# Altium schematic sheet ARM2toARM3PGA_FPA.SchDoc: ARM2 to ARM3 Adapter
size A3; DocumentNumber: 1; SheetNumber: 1; SheetTotal: 1
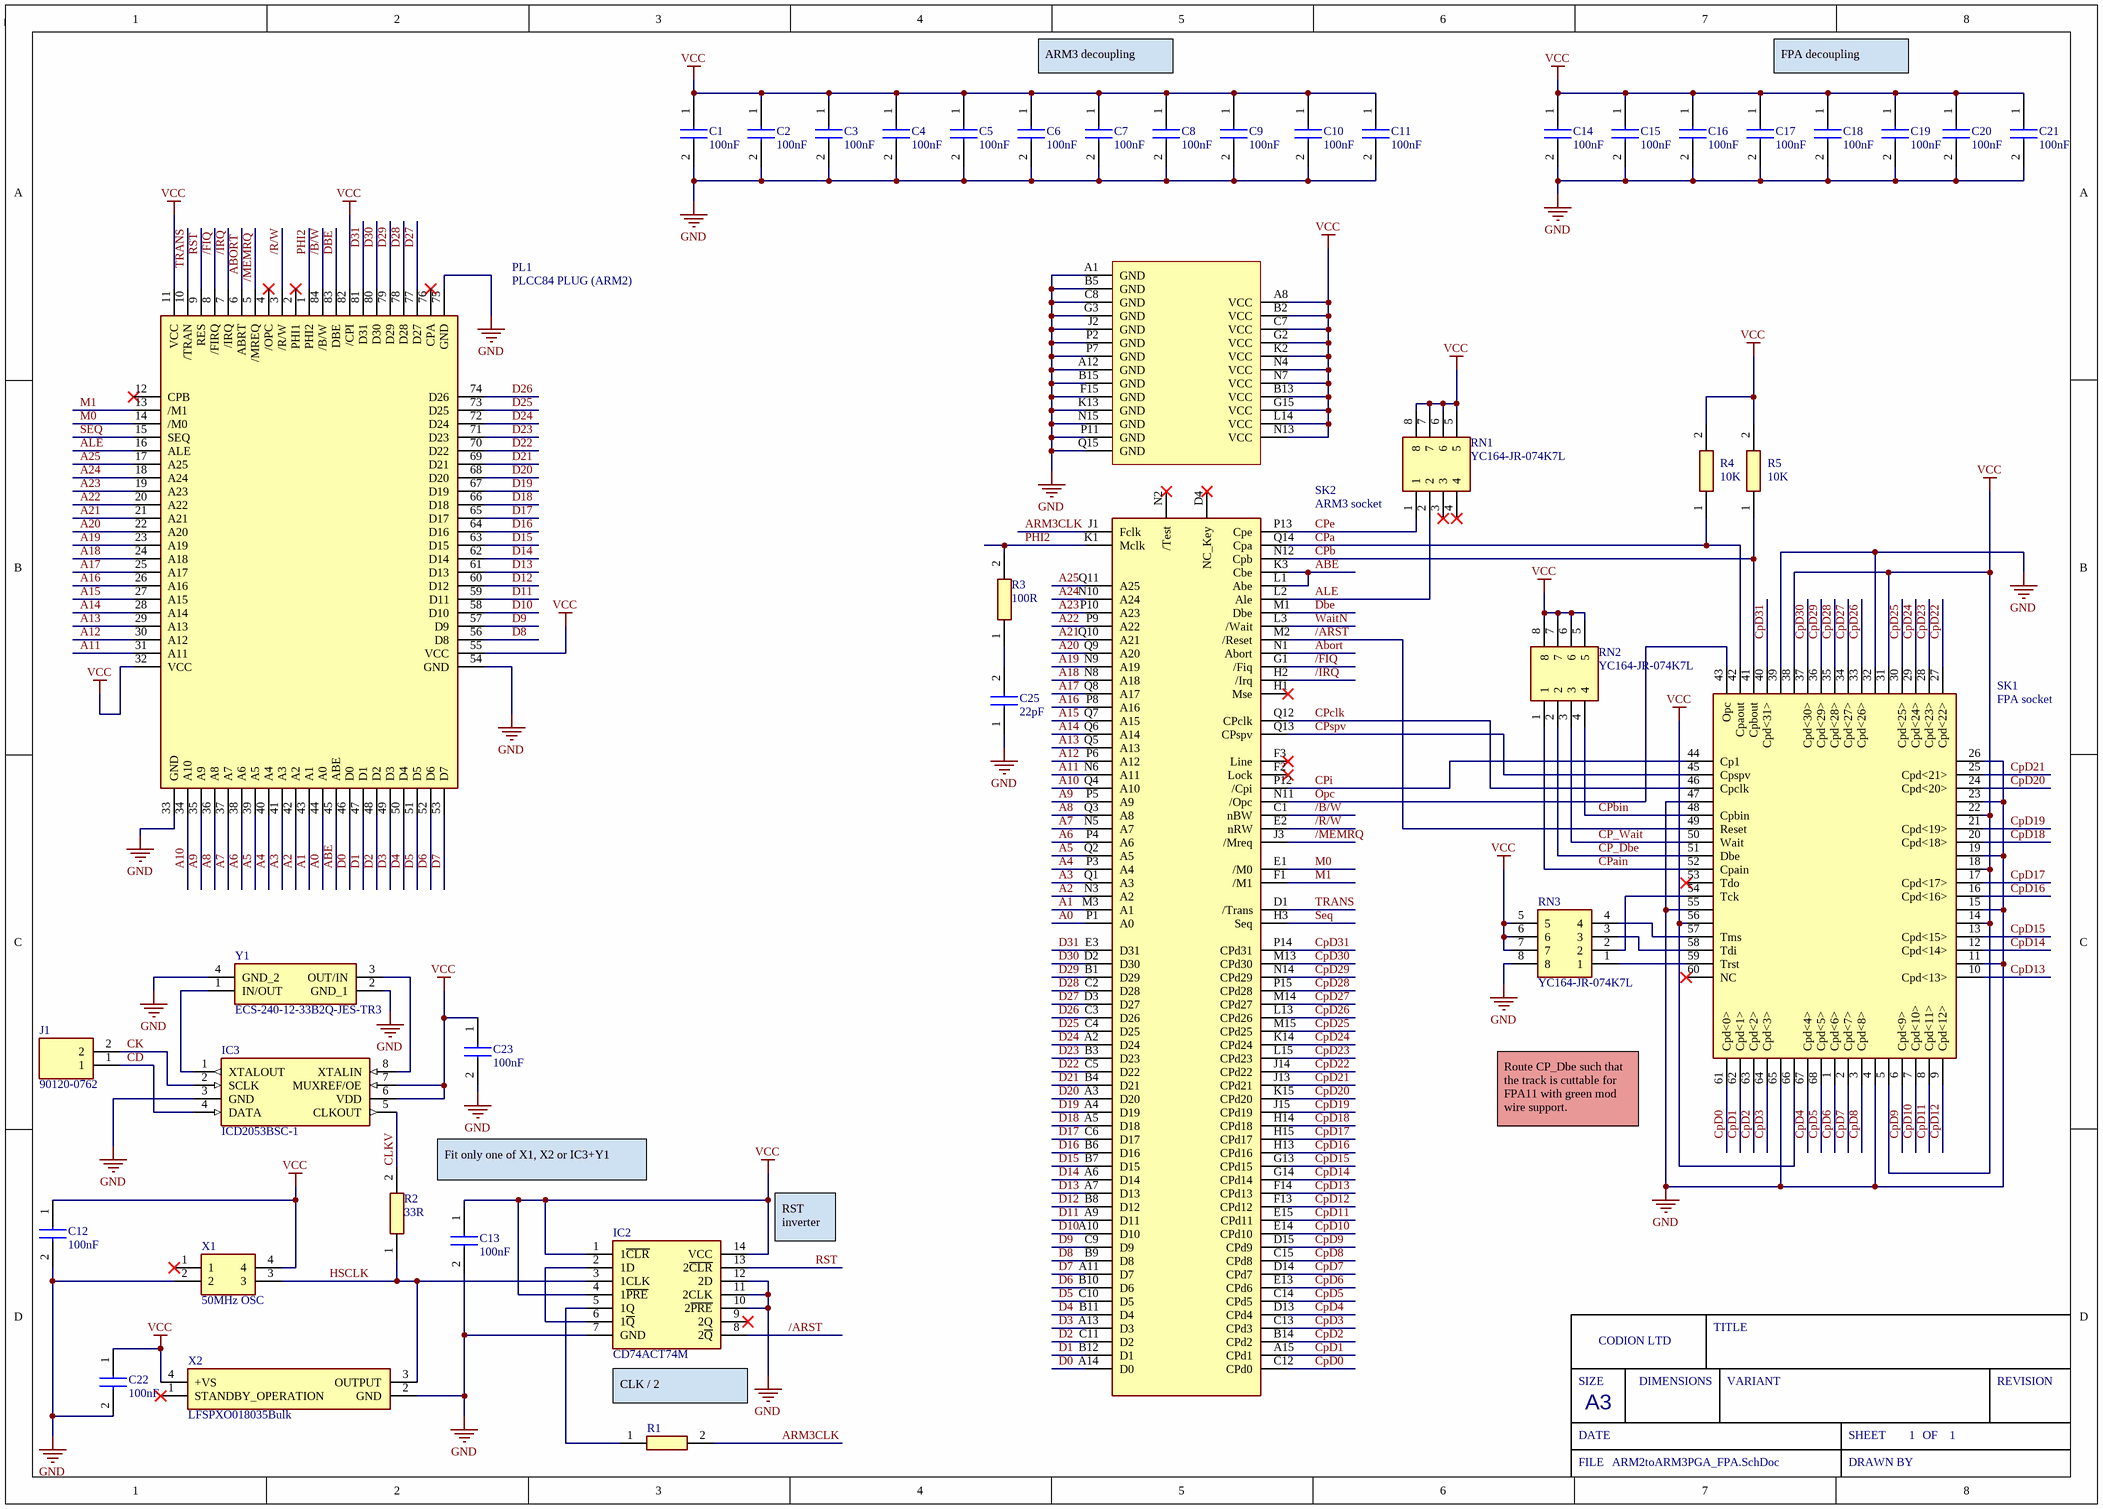
[diagram p0: ARM2toARM3PGA_FPA.SchDoc]

## Parts
C1  100nF  [CAPC2012X145N]
C2  100nF  [CAPC2012X145N]
C3  100nF  [CAPC2012X145N]
C4  100nF  [CAPC2012X145N]
C5  100nF  [CAPC2012X145N]
C6  100nF  [CAPC2012X145N]
C7  100nF  [CAPC2012X145N]
C8  100nF  [CAPC2012X145N]
C9  100nF  [CAPC2012X145N]
C10  100nF  [CAPC2012X145N]
C11  100nF  [CAPC2012X145N]
C12  100nF  [CAPC2012X145N]
C13  100nF  [CAPC2012X145N]
C14  100nF  [CAPC2012X145N]
C15  100nF  [CAPC2012X145N]
C16  100nF  [CAPC2012X145N]
C17  100nF  [CAPC2012X145N]
C18  100nF  [CAPC2012X145N]
C19  100nF  [CAPC2012X145N]
C20  100nF  [CAPC2012X145N]
C21  100nF  [CAPC2012X145N]
C22  100nF  [CAPC2012X145N]
C23  100nF  [CAPC2012X145N]
C25  22pF  [CAPC1608X90N]
IC2  CD74ACT74M  [SOIC127P600X175-14N]
IC3  ICD2053BSC-1  [SOIC127P602X173-8N]
J1  90120-0762  [HDRV2W35P0X254_1X2_508X249X560P]
PL1  PLCC84 PLUG (ARM2)  [PLCC84_PLUG]
R1  CRCW080568R0FKEA  [RESC2012X50N]  (value not drawn)
R2  33R  [RESC1005X40N]
R3  100R  [RESC2012X60N]
R4  10K  [RESC2012X60N]
R5  10K  [RESC2012X60N]
RN1  YC164-JR-074K7L  [YC164JR07220RL]
RN2  YC164-JR-074K7L  [YC164JR07220RL]
RN3  YC164-JR-074K7L  [YC164JR07220RL]
SK1  FPA socket  [MEMC_Socket]
SK2  ARM3 socket  [PGA_ARM3]
X1  50MHz OSC  [DIPS762W56P1524L1778H241Q4N]
X2  LFSPXO018035Bulk  [LFSPXO018035Bulk]
Y1  ECS-240-12-33B2Q-JES-TR3  [ECS2401233B2QJESTR3]

## Nets
GND: C1.2 C2.2 C3.2 C4.2 C5.2 C6.2 C7.2 C8.2 C9.2 C10.2 C11.2 C12.2 C13.2 C14.2 C15.2 C16.2 C17.2 C18.2 C19.2 C20.2 C21.2 C22.2 C23.2 C25.1 IC2.7(GND) IC2.10(2~{PRE}) IC2.11(2CLK) IC2.12(2D) IC3.3(GND) PL1.33(GND) PL1.54(GND) PL1.75(GND) RN3.8 SK1.4 SK1.11 SK1.15 SK1.19 SK1.23 SK1.26 SK1.32 SK1.39 SK1.47 SK1.55 SK1.65 SK2.A1(GND) SK2.A12(GND) SK2.B5(GND) SK2.B15(GND) SK2.C8(GND) SK2.F15(GND) SK2.G3(GND) SK2.J2(GND) SK2.K13(GND) SK2.N15(GND) SK2.P2(GND) SK2.P7(GND) SK2.P11(GND) SK2.Q15(GND) X1.2 X2.2(GND) Y1.2(GND_1) Y1.4(GND_2)
VCC: C1.1 C2.1 C3.1 C4.1 C5.1 C6.1 C7.1 C8.1 C9.1 C10.1 C11.1 C12.1 C13.1 C14.1 C15.1 C16.1 C17.1 C18.1 C19.1 C20.1 C21.1 C22.1 C23.1 IC2.1(1~{CLR}) IC2.4(1~{PRE}) IC2.14(VCC) IC3.6(VDD) IC3.7(MUXREF/OE) PL1.11(VCC) PL1.32(VCC) PL1.55(VCC) PL1.82(/CPI) R4.2 R5.2 RN1.5 RN1.6 RN1.7 RN1.8 RN2.5 RN2.6 RN2.7 RN2.8 RN3.5 RN3.6 RN3.7 SK1.5 SK1.14 SK1.18 SK1.22 SK1.31 SK1.38 SK1.56 SK1.66 SK2.A8(VCC) SK2.B2(VCC) SK2.B13(VCC) SK2.C7(VCC) SK2.G2(VCC) SK2.G15(VCC) SK2.K2(VCC) SK2.L14(VCC) SK2.N4(VCC) SK2.N7(VCC) SK2.N13(VCC) X1.4 X2.4(+VS)
/ARST: IC2.8(2~{Q}) SK1.49(Reset) SK2.M2(/Reset)
/B/W: PL1.84(/B/W) SK2.C1(nBW)
/FIQ: PL1.8(/FIRQ) SK2.G1(/Fiq)
/IRQ: PL1.7(/IRQ) SK2.H2(/Irq)
/MEMRQ: PL1.5(/MREQ) SK2.J3(/Mreq)
/R/W: PL1.3(/R/W) SK2.E2(nRW)
A0: PL1.44(A0) SK2.P1(A0)
A1: PL1.43(A1) SK2.M3(A1)
A2: PL1.42(A2) SK2.N3(A2)
A3: PL1.41(A3) SK2.Q1(A3)
A4: PL1.40(A4) SK2.P3(A4)
A5: PL1.39(A5) SK2.Q2(A5)
A6: PL1.38(A6) SK2.P4(A6)
A7: PL1.37(A7) SK2.N5(A7)
A8: PL1.36(A8) SK2.Q3(A8)
A9: PL1.35(A9) SK2.P5(A9)
A10: PL1.34(A10) SK2.Q4(A10)
A11: PL1.31(A11) SK2.N6(A11)
A12: PL1.30(A12) SK2.P6(A12)
A13: PL1.29(A13) SK2.Q5(A13)
A14: PL1.28(A14) SK2.Q6(A14)
A15: PL1.27(A15) SK2.Q7(A15)
A16: PL1.26(A16) SK2.P8(A16)
A17: PL1.25(A17) SK2.Q8(A17)
A18: PL1.24(A18) SK2.N8(A18)
A19: PL1.23(A19) SK2.N9(A19)
A20: PL1.22(A20) SK2.Q9(A20)
A21: PL1.21(A21) SK2.Q10(A21)
A22: PL1.20(A22) SK2.P9(A22)
A23: PL1.19(A23) SK2.P10(A23)
A24: PL1.18(A24) SK2.N10(A24)
A25: PL1.17(A25) SK2.Q11(A25)
ABE: PL1.45(ABE) SK2.K3(Cbe) SK2.L1(Abe)
ABORT: PL1.6(ABRT) SK2.N1(Abort)
ALE: PL1.16(ALE) RN1.2 SK2.L2(Ale)
ARM3CLK: R1.2 SK2.J1(Fclk)
CD: IC3.4(DATA) J1.1
CK: IC3.2(SCLK) J1.2
CLKV: IC3.5(CLKOUT) R2.2
CP_Dbe: RN2.2 SK1.51(Dbe)
CP_Wait: RN2.3 SK1.50(Wait)
CPa: R4.1 SK1.42(Cpaout) SK2.Q14(Cpa)
CPain: RN2.1 SK1.52(Cpain)
CPb: R5.1 SK1.41(Cpbout) SK2.N12(Cpb)
CPbin: RN2.4 SK1.48(Cpbin)
CPclk: SK1.46(Cpclk) SK2.Q12(CPclk)
CpD0: SK1.61(Cpd<0>) SK2.C12(CPd0)
CpD1: SK1.62(Cpd<1>) SK2.A15(CPd1)
CpD2: SK1.63(Cpd<2>) SK2.B14(CPd2)
CpD3: SK1.64(Cpd<3>) SK2.C13(CPd3)
CpD4: SK1.67(Cpd<4>) SK2.D13(CPd4)
CpD5: SK1.68(Cpd<5>) SK2.C14(CPd5)
CpD6: SK1.1(Cpd<6>) SK2.E13(CPd6)
CpD7: SK1.2(Cpd<7>) SK2.D14(CPd7)
CpD8: SK1.3(Cpd<8>) SK2.C15(CPd8)
CpD9: SK1.6(Cpd<9>) SK2.D15(CPd9)
CpD10: SK1.7(Cpd<10>) SK2.E14(CPd10)
CpD11: SK1.8(Cpd<11>) SK2.E15(CPd11)
CpD12: SK1.9(Cpd<12>) SK2.F13(CPd12)
CpD13: SK1.10(Cpd<13>) SK2.F14(CPd13)
CpD14: SK1.12(Cpd<14>) SK2.G14(CPd14)
CpD15: SK1.13(Cpd<15>) SK2.G13(CPd15)
CpD16: SK1.16(Cpd<16>) SK2.H13(CPd16)
CpD17: SK1.17(Cpd<17>) SK2.H15(CPd17)
CpD18: SK1.20(Cpd<18>) SK2.H14(CPd18)
CpD19: SK1.21(Cpd<19>) SK2.J15(CPd19)
CpD20: SK1.24(Cpd<20>) SK2.K15(CPd20)
CpD21: SK1.25(Cpd<21>) SK2.J13(CPd21)
CpD22: SK1.27(Cpd<22>) SK2.J14(CPd22)
CpD23: SK1.28(Cpd<23>) SK2.L15(CPd23)
CpD24: SK1.29(Cpd<24>) SK2.K14(CPd24)
CpD25: SK1.30(Cpd<25>) SK2.M15(CPd25)
CpD26: SK1.33(Cpd<26>) SK2.L13(CPd26)
CpD27: SK1.34(Cpd<27>) SK2.M14(CPd27)
CpD28: SK1.35(Cpd<28>) SK2.P15(CPd28)
CpD29: SK1.36(Cpd<29>) SK2.N14(CPd29)
CpD30: SK1.37(Cpd<30>) SK2.M13(CPd30)
CpD31: SK1.40(Cpd<31>) SK2.P14(CPd31)
CPe: RN1.1 SK2.P13(Cpe)
CPi: SK1.44(Cp1) SK2.P12(/Cpi)
CPspv: SK1.45(Cpspv) SK2.Q13(CPspv)
D0: PL1.46(D0) SK2.A14(D0)
D1: PL1.47(D1) SK2.B12(D1)
D2: PL1.48(D2) SK2.C11(D2)
D3: PL1.49(D3) SK2.A13(D3)
D4: PL1.50(D4) SK2.B11(D4)
D5: PL1.51(D5) SK2.C10(D5)
D6: PL1.52(D6) SK2.B10(D6)
D7: PL1.53(D7) SK2.A11(D7)
D8: PL1.56(D8) SK2.B9(D8)
D9: PL1.57(D9) SK2.C9(D9)
D10: PL1.58(D10) SK2.A10(D10)
D11: PL1.59(D11) SK2.A9(D11)
D12: PL1.60(D12) SK2.B8(D12)
D13: PL1.61(D13) SK2.A7(D13)
D14: PL1.62(D14) SK2.A6(D14)
D15: PL1.63(D15) SK2.B7(D15)
D16: PL1.64(D16) SK2.B6(D16)
D17: PL1.65(D17) SK2.C6(D17)
D18: PL1.66(D18) SK2.A5(D18)
D19: PL1.67(D19) SK2.A4(D19)
D20: PL1.68(D20) SK2.A3(D20)
D21: PL1.69(D21) SK2.B4(D21)
D22: PL1.70(D22) SK2.C5(D22)
D23: PL1.71(D23) SK2.B3(D23)
D24: PL1.72(D24) SK2.A2(D24)
D25: PL1.73(D25) SK2.C4(D25)
D26: PL1.74(D26) SK2.C3(D26)
D27: PL1.77(D27) SK2.D3(D27)
D28: PL1.78(D28) SK2.C2(D28)
D29: PL1.79(D29) SK2.B1(D29)
D30: PL1.80(D30) SK2.D2(D30)
D31: PL1.81(D31) SK2.E3(D31)
DBE: PL1.83(DBE) SK2.M1(Dbe)
HSCLK: IC2.3(1CLK) R2.1 X1.3 X2.3(OUTPUT)
M0: PL1.14(/M0) SK2.E1(/M0)
M1: PL1.13(/M1) SK2.F1(/M1)
Opc: SK1.43(Opc) SK2.N11(/Opc)
PHI2: PL1.1(PHI2) R3.2 SK2.K1(Mclk)
RST: IC2.13(2~{CLR}) PL1.9(RES)
SEQ: PL1.15(SEQ) SK2.H3(Seq)
TRANS: PL1.10(/TRAN) SK2.D1(/Trans)
WaitN: SK2.L3(/Wait)
NetC25_2: C25.2 R3.1
NetIC2_2: IC2.2(1D) IC2.6(1~{Q})
NetIC2_5: IC2.5(1Q) R1.1
NetIC3_1: IC3.1(XTALOUT) Y1.1(IN/OUT)
NetIC3_8: IC3.8(XTALIN) Y1.3(OUT/IN)
NetRN3_1: RN3.1 SK1.59(Trst)
NetRN3_2: RN3.2 SK1.54(Tck)
NetRN3_3: RN3.3 SK1.58(Tdi)
NetRN3_4: RN3.4 SK1.57(Tms)

Not connected (* = marked no-connect by the designer): IC2 9(2Q)*; PL1 2(PHI1)* 4(/OPC)* 12(CPB)* 76(CPA)*; RN1 3* 4*; SK1 53(Tdo)* 60(NC)*; SK2 D4(NC_Key)* F2(Lock)* F3(Line)* H1(Mse)* N2(/Test)*; X1 1*; X2 1(STANDBY_OPERATION)*

## Notes on the sheet
- ARM3 decoupling
- FPA decoupling
- Route CP_Dbe such that the track is cuttable for FPA11 with green mod wire support.
- Fit only one of X1, X2 or IC3+Y1
- RST inverter
- CLK / 2
- SIZE
- CODION LTD
- DIMENSIONS
- TITLE
- VARIANT
- REVISION
- DATE
- A3
- SHEET
- OF
- FILE
- DRAWN BY

## Library data of the parts
C1-C23 = C2012X7R1H104K125AM: Capacitor; Manufacturer_Name: TDK; Datasheet Link: https://product.tdk.com/info/en/catalog/datasheets/mlcc_commercial_midvoltage_en.pdf; Height: 1.45mm; Manufacturer_Part_Number: C2012X7R1H104K125AM; Mouser Part Number: 810-C2012X7R1H104KT5; Mouser Price/Stock: https://www.mouser.com/Search/Refine.aspx?Keyword=810-C2012X7R1H104KT5; Arrow Part Number: C2012X7R1H104K125AM; Arrow Price/Stock: https://www.arrow.com/en/products/c2012x7r1h104k125am/tdk; LCSC Part #: C111492
C25 = CGA3E2NP02A220J080AA: Capacitor; Manufacturer_Name: TDK; Datasheet Link: http://docs-europe.electrocomponents.com/webdocs/14e9/0900766b814e9125.pdf; Height: 0.9mm; Manufacturer_Part_Number: CGA3E2NP02A220J080AA; Mouser Part Number: 810-CGA3E2NP02A220JA
IC2 = CD74ACT74M: Integrated Circuit; Manufacturer_Name: Texas Instruments; Datasheet Link: http://www.ti.com/lit/ds/symlink/cd74act74.pdf; Height: 1.75mm; Manufacturer_Part_Number: CD74ACT74M; Mouser Part Number: 595-CD74ACT74M; Mouser Price/Stock: https://www.mouser.com/Search/Refine.aspx?Keyword=595-CD74ACT74M
IC3 = ICD2053BSC-1: Integrated Circuit; Manufacturer_Name: Cypress Semiconductor; Datasheet Link: https://www.datasheetarchive.com/pdf/download.php?id=dd30b21a5d816c93cddfaa73a395283274a84c&type=M&term=ICD2053; Height: 1.727mm; Manufacturer_Part_Number: ICD2053BSC-1
J1 = 90120-0762: Connector; Manufacturer_Name: Molex; Datasheet Link: http://www.molex.com/pdm_docs/sd/901200762_sd.pdf; Height: 5.6mm; Manufacturer_Part_Number: 90120-0762; Mouser Part Number: 538-90120-0762; Mouser Price/Stock: https://www.mouser.co.uk/ProductDetail/Molex/90120-0762?qs=NKHyz0HolODkarWFh2VFww%3D%3D; Arrow Part Number: 90120-0762; Arrow Price/Stock: https://www.arrow.com/en/products/90120-0762/molex?region=nac
PL1 = PLCC84_PLUG_ARM2: PLCC84 Plug; Manufacturer_Name: Winslow; Manufacturer_Part_Number: W9328; Height: 15mm
R1 = CRCW080568R0FKEA: Resistor; Manufacturer_Name: Vishay; Datasheet Link: http://www.vishay.com/docs/20035/dcrcwe3.pdf; Height: 0.5mm; Manufacturer_Part_Number: CRCW080568R0FKEA; Mouser Part Number: 71-CRCW080568R0FKEA; Mouser Price/Stock: https://www.mouser.com/Search/Refine.aspx?Keyword=71-CRCW080568R0FKEA; Arrow Part Number: CRCW080568R0FKEA; Arrow Price/Stock: https://www.arrow.com/en/products/crcw080568r0fkea/vishay
R2 = CRCW040233R0FKED: Resistor; Manufacturer_Name: Vishay; Datasheet Link: http://www.vishay.com/docs/20035/dcrcwe3.pdf; Height: 0.4mm; Manufacturer_Part_Number: CRCW040233R0FKED; Mouser Part Number: 71-CRCW0402-33-E3; Mouser Price/Stock: https://www.mouser.co.uk/ProductDetail/Vishay-Dale/CRCW040233R0FKED?qs=TNtMkGKFKOyo77UGFlXIJw%3D%3D; Arrow Part Number: CRCW040233R0FKED; Arrow Price/Stock: https://www.arrow.com/en/products/crcw040233r0fked/vishay; LCSC Part #: C137880
R3 = CRCW0805100RFKEAC: Resistor; Manufacturer_Name: Vishay; Datasheet Link: https://componentsearchengine.com/Datasheets/1/CRCW0805100RFKEAC.pdf; Height: 0.6mm; Manufacturer_Part_Number: CRCW0805100RFKEAC; Mouser Part Number: 71-CRCW0805100RFKEAC; Mouser Price/Stock: https://www.mouser.co.uk/ProductDetail/Vishay-Dale/CRCW0805100RFKEAC?qs=E3Y5ESvWgWM6LN%2Fsc41QGg%3D%3D; Arrow Part Number: CRCW0805100RFKEAC; Arrow Price/Stock: https://www.arrow.com/en/products/crcw0805100rfkeac/vishay?region=nac
R4 R5 = RC0805JR-0710KL: Resistor; Manufacturer_Name: KEMET; Datasheet Link: https://datasheet.datasheetarchive.com/originals/distributors/Datasheets_SAMA/902f9e387b938f871d31120f5fc1d65e.pdf; Height: 0.6mm; Manufacturer_Part_Number: RC0805JR-0710KL; Mouser Part Number: 603-RC0805JR-0710KL; Mouser Price/Stock: https://www.mouser.co.uk/ProductDetail/YAGEO/RC0805JR-0710KL?qs=ZFGQJeMQzF5q%2Fp77vM%2FrVQ%3D%3D; Arrow Part Number: RC0805JR-0710KL; Arrow Price/Stock: https://www.arrow.com/en/products/rc0805jr-0710kl/yageo
RN1-RN3 = YC164-JR-074K7L: Resistor Network; Manufacturer_Name: KEMET; Datasheet Link: https://media.digikey.com/pdf/Data%20Sheets/Yageo%20PDFs/YC102-358,TC122-164_Series_DS.pdf; Height: 0mm; Manufacturer_Part_Number: YC164-JR-074K7L; Mouser Part Number: 603-YC164-JR-074K7L; Mouser Price/Stock: https://www.mouser.co.uk/ProductDetail/YAGEO/YC164-JR-074K7L?qs=R3r%2F0p8sX68YCHdOvgl0Gg%3D%3D; Arrow Part Number: YC164-JR-074K7L; Arrow Price/Stock: https://www.arrow.com/en/products/yc164-jr-074k7l/yageo?region=nac
SK1 = FPA_SKT: Manufacturer_Name: 3M; Manufacturer_Part_Number: 8468-21B1-RK-TR; Datasheet Link: https://www.arrow.com/en/products/8468-21b1-rk-tr/3m; Height: 4.6mm; Mouser Part Number: 517-8468-21B1-RK-TR; Mouser Price/Stock: https://www.mouser.co.uk/ProductDetail/3M-Electronic-Solutions-Division/8468-21B1-RK-TR?qs=X%2F%2F06fXhnJ18zOj3KK47CQ%3D%3D; Arrow Part Number: 8468-21B1-RK-TR; Arrow Price/Stock: https://www.arrow.com/en/products/8468-21b1-rk-tr/3m
SK2 = PGA_ARM3: ARM3
X1 = 1107741: Manufacturer_Name: ARIES; Datasheet Link: http://docs-emea.rs-online.com/webdocs/13f3/0900766b813f3237.pdf; Height: 2.41mm; Manufacturer_Part_Number: 1107741; Mouser Part Number: 535-1107741; Mouser Price/Stock: https://www.mouser.co.uk/ProductDetail/Aries-Electronics/1107741?qs=WZRMhwwaLl%2FApwqojhfzdA%3D%3D
X2 = LFSPXO018035Bulk: Crystal or Oscillator; Manufacturer_Name: IQD; Datasheet Link: https://www.iqdfrequencyproducts.com/products/pn/LFSPXO018035Bulk.pdf; Height: 1.4mm; Manufacturer_Part_Number: LFSPXO018035Bulk; Mouser Part Number: 449-LFSPXO018035BULK; Mouser Price/Stock: https://www.mouser.com/Search/Refine.aspx?Keyword=449-LFSPXO018035BULK
Y1 = ECS-240-12-33B2Q-JES-TR3: Crystal or Oscillator; Manufacturer_Name: ECS; Datasheet Link: https://ecsxtal.com/store/pdf/ECX-33B2Q.pdf; Height: 0.8mm; Manufacturer_Part_Number: ECS-240-12-33B2Q-JES-TR3